# EAGLE schematic Attiny bot (EAGLE 7.2.0)
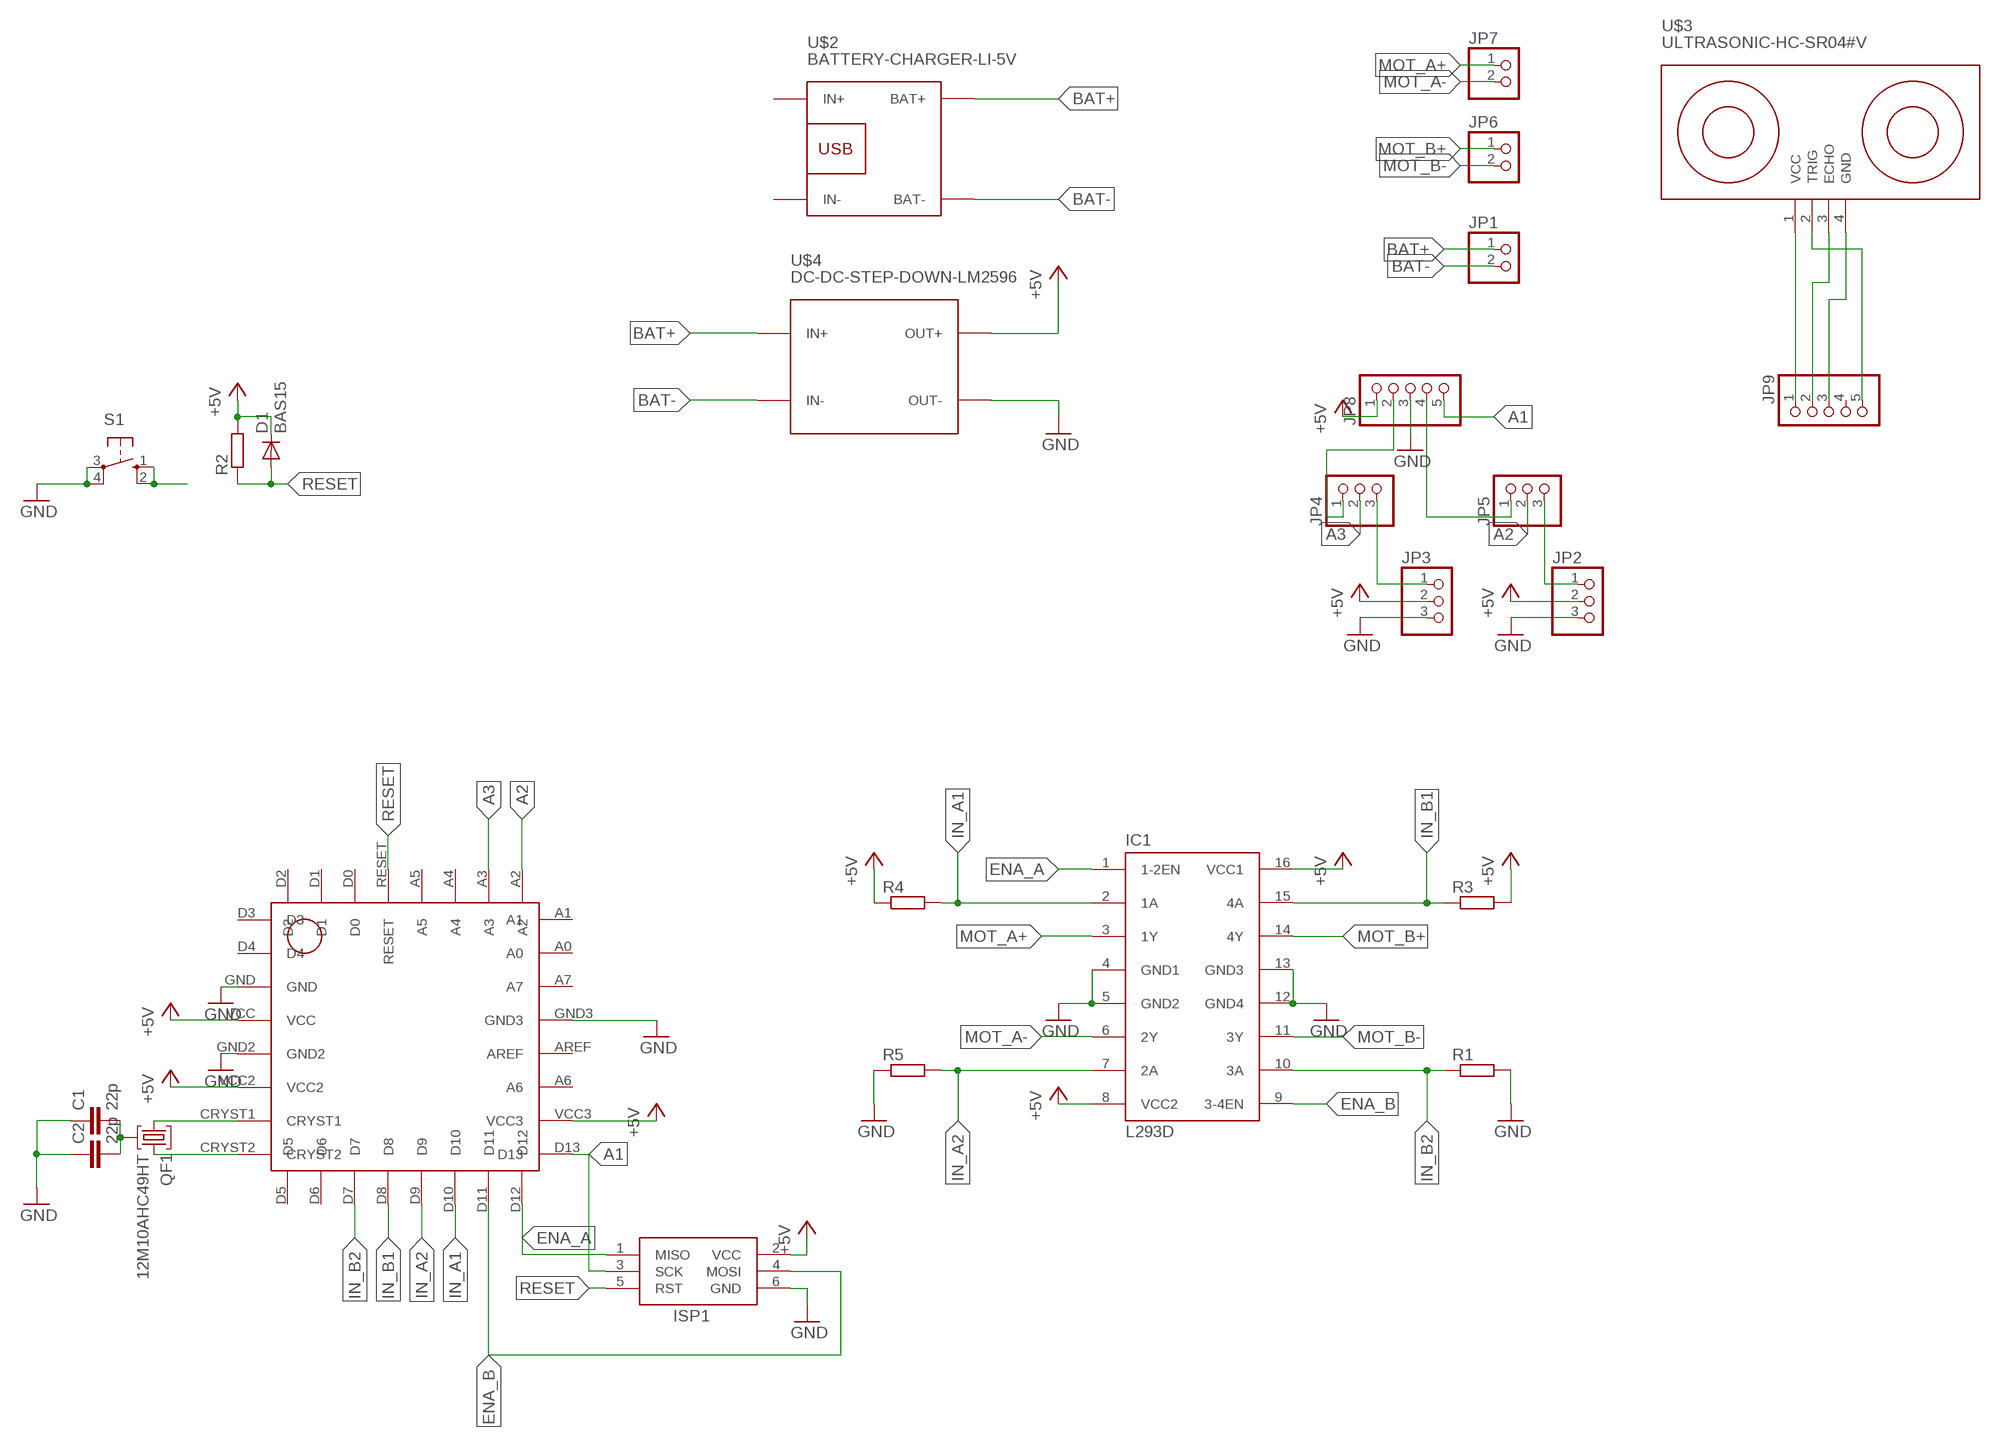
[diagram p0: schematic, sheet 1]

## Parts
C1  22p  C-EUC1206  [C1206]
C2  22p  C-EUC1206  [C1206]
D1  BAS15  [DO34-7]
IC1  L293D  [DIL16]
ISP1  AVRISP-6  [AVRISP]
JP1  PINHD-1X2  [1X02]
JP2  PINHD-1X3  [1X03]
JP3  PINHD-1X3  [1X03]
JP4  PINHD-1X3  [1X03]
JP5  PINHD-1X3  [1X03]
JP6  PINHD-1X2  [1X02]
JP7  PINHD-1X2  [1X02]
JP8  PINHD-1X5  [1X05]
JP9  PINHD-1X5  [1X05]
QF1  12M10AHC49HT  [HC49U]
R1  R-EU_R1206  [R1206]
R2  R-EU_R1206  [R1206]
R3  R-EU_R1206  [R1206]
R4  R-EU_R1206  [R1206]
R5  R-EU_R1206  [R1206]
S1  10-XX  [B3F-10XX]
U$1  PROCESSOR  [PROCESOR]
U$2  BATTERY-CHARGER-LI-5V  [BATTERY-CHARGER-LI-5V]
U$3  ULTRASONIC-HC-SR04#V  [ULTRASONIC-HC-SR04#V]
U$4  DC-DC-STEP-DOWN-LM2596  [DC-DC-STEP-DOWN-LM2596]

## Nets
+5V: D1.C IC1.8(VCC2) IC1.16(VCC1) ISP1.2(VCC) JP2.2 JP3.2 JP8.1 R2.2 R3.2 R4.1 U$1.VCC U$1.VCC2 U$1.VCC3 U$4.OUT+
A1: ISP1.3(SCK) JP8.5 U$1.D13
A2: JP5.2 U$1.A2
A3: JP4.2 U$1.A3
BAT+: JP1.1 U$2.BAT+ U$4.IN+
BAT-: JP1.2 U$2.BAT- U$4.IN-
ENA_A: IC1.1(1-2EN) ISP1.1(MISO) U$1.D12
ENA_B: IC1.9(3-4EN) ISP1.4(MOSI) U$1.D11
GND: C1.1 C2.1 IC1.4(GND1) IC1.5(GND2) IC1.12(GND4) IC1.13(GND3) ISP1.6(GND) JP2.3 JP3.3 JP8.3 R1.2 R5.1 S1.3(P) S1.4(P1) U$1.GND U$1.GND2 U$1.GND3 U$4.OUT-
IN_A1: IC1.2(1A) R4.2 U$1.D10
IN_A2: IC1.7(2A) R5.2 U$1.D9
IN_B1: IC1.15(4A) R3.1 U$1.D8
IN_B2: IC1.10(3A) R1.1 U$1.D7
MOT_A+: IC1.3(1Y) JP7.1
MOT_A-: IC1.6(2Y) JP7.2
MOT_B+: IC1.14(4Y) JP6.1
MOT_B-: IC1.11(3Y) JP6.2
N$1: JP9.3 U$3.4(GND)
N$2: JP9.1 U$3.1(VCC)
N$3: QF1.3 U$1.CRYST2
N$4: QF1.1 U$1.CRYST1
N$5: C1.2 C2.2 QF1.2
N$6: JP3.1 JP4.3
N$7: S1.1(S) S1.2(S1)
N$8: JP2.1 JP5.3
N$9: JP9.5 U$3.2(TRIG)
N$10: JP9.2 U$3.3(ECHO)
N$11: JP5.1 JP8.4
N$12: JP4.1 JP8.2
RESET: D1.A ISP1.5(RST) R2.1 U$1.RESET
Unconnected: JP9.4 U$1.A0 U$1.A1 U$1.A4 U$1.A5 U$1.A6 U$1.A7 U$1.AREF U$1.D0 U$1.D1 U$1.D2 U$1.D3 U$1.D4 U$1.D5 U$1.D6 U$2.IN+ U$2.IN-

## Library data of the parts
C1 C2 = rcl:C-EU: CAPACITOR, European symbol
D1 = diode:BAS15: DIODE high speed
IC1 = st-microelectronics:L293D: PUSH-PULL 4 CHANNEL DRIVER; MPN: L293D; OC_FARNELL: 9589619; OC_NEWARK: 56P8249
ISP1 = adafruit:AVRISP: AVR ISP HEADER Standard 6 pin header for AVR programming
JP1 JP6 JP7 = pinhead:PINHD-1X2: PIN HEADER
JP2-JP5 = pinhead:PINHD-1X3: PIN HEADER
JP8 JP9 = pinhead:PINHD-1X5: PIN HEADER
QF1 = crystal:12M10AHC49HT: Monolithic Crystal Filters Source: www.vanlong.com; OC_FARNELL: unknown; OC_NEWARK: unknown
R1-R5 = rcl:R-EU_: RESISTOR, European symbol
S1 = switch-omron:10-XX: OMRON SWITCH; MPN: B3F-1000; OC_FARNELL: 176432; OC_NEWARK: 36M3542
U$1 = PROCESSOR:PROCESSOR
U$2 = diy-modules:BATTERY-CHARGER-LI-5V: Lithium Battery 5V Charger More details available here: http://www.buildcircuit.com/how-to-use-micro-usb-5v-1a-lithium-battery-charging-board-charger-module/ Click here to find device on ebay.com <http://www.ebay.com/sch/tp4056+charger+usb>
U$3 = diy-modules:ULTRASONIC-HC-SR04: Ultrasonic Ranging Module HC-SR04 More details available here: http://randomnerdtutorials.com/complete-guide-for-ultrasonic-sensor-hc-sr04/ Click here to find device on ebay.com <http://www.ebay.com/sch/hc+sr04+ultrasonic>
U$4 = diy-modules:DC-DC-STEP-DOWN-LM2596: DC/DC Step-Down Regulator based on LM2596-ADJ chip LM2596 datasheet available here: http://www.ti.com/lit/ds/symlink/lm2596.pdf Click here to find device on ebay.com <http://www.ebay.com/sch/lm2596+power+regulator>